# Altium project NearFieldProbeSet.PrjPcb
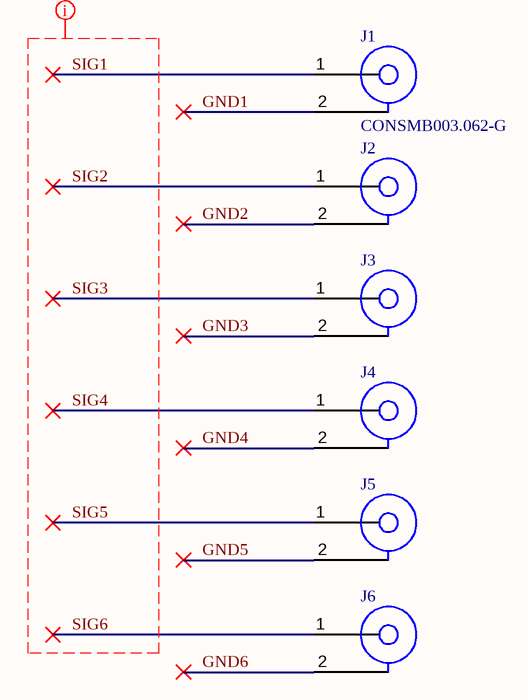
[diagram p0: NearFieldProbeSet.SchDoc]
1 sheet, 6 parts. Net scope: global (net labels, ports and power ports of the same name join across sheets).
Board file: NearFieldProbeSet.PcbDoc

## Sheet NearFieldProbeSet.SchDoc
size 420 x 297 mm; Organization: Digitrol Ltd.; Address1: Digitrol House; Address2: Coronet Way; Address3: Swansea Enterprise Park; Address4: SWANSEA; SheetNumber: 1; SheetTotal: 1; Address5: SA6 8RH; Telephone: 01792 796000

### Parts
J1  CONSMB003.062-G  [CONSMB003.062-G]
J2  CONSMB003.062-G  [CONSMB003.062-G]  (value not drawn)
J3  CONSMB003.062-G  [CONSMB003.062-G]  (value not drawn)
J4  CONSMB003.062-G  [CONSMB003.062-G]  (value not drawn)
J5  CONSMB003.062-G  [CONSMB003.062-G]  (value not drawn)
J6  CONSMB003.062-G  [CONSMB003.062-G]  (value not drawn)

### Nets
GND1: J1.2(RF_GND)
GND2: J2.2(RF_GND)
GND3: J3.2(RF_GND)
GND4: J4.2(RF_GND)
GND5: J5.2(RF_GND)
GND6: J6.2(RF_GND)
SIG1: J1.1(RF)
SIG2: J2.1(RF)
SIG3: J3.1(RF)
SIG4: J4.1(RF)
SIG5: J5.1(RF)
SIG6: J6.1(RF)

### Layout directives
net class 50R: SIG1, SIG2, SIG3, SIG4, SIG5, SIG6

### Notes on the sheet
- THIS DOCUMENT AND THE DATA DISCLOSED HEREIN OR
- HEREWITH IS THE PROPERTY OF ALTIUM LIMITED AND MAY
- DWG NO:
- REVISION
- REV:
- DESCRIPTION
- DATE
- APPROVED
- BE FREELY DISTRIBUTED IN WHOLE. NO RIGHTS ARE
- RESERVED OR EXPRESS OR IMPLIED WARANTEE GIVEN.
- ENG:
- APPROVALS
- PROJECT
- DSN:
- CHK:
- REFERENCE DOCUMENTS
- PROJECT REVISION:
- TITLE
- DOCUMENT REVISION:
- DESIGN ITEM:
- BOM:
- FAB DWG:
- PCB DWG:
- ASSY DWG:
- SCALE:
- A3
- SIZE
- CAGE CODE
- FILE NAME
- DWG NO.
- SHEET
- OF
- REV

### Library data of the parts
J1-J6 = CMP-000015-1: Connector - SMB Socket, straddle mount; pin to pad: 2>2+3+4+5

## Assembly variants
Main: all parts fitted